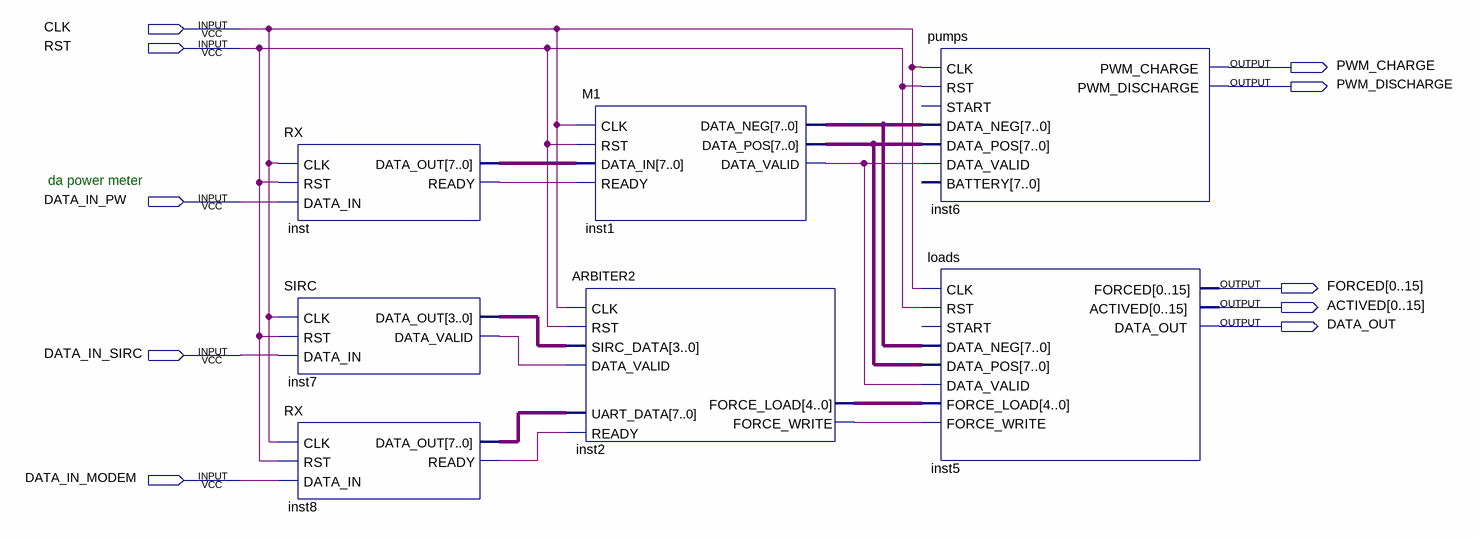
[diagram p0: schematic sheet]
// Quartus schematic innovate.bdf as structural Verilog: 7 symbols, 10 pins
module innovate (
  input  CLK,
  input  RST,
  input  DATA_IN_PW,
  input  DATA_IN_SIRC,
  input  DATA_IN_MODEM,
  output PWM_CHARGE,
  output PWM_DISCHARGE,
  output [0:15] FORCED,
  output [0:15] ACTIVED,
  output DATA_OUT
);

  wire inst1_data_valid, inst2_force_write, inst7_data_valid, inst8_ready, inst_ready;
  wire [3:0] inst7_data_out;
  wire [4:0] inst2_force_load;
  wire [7:0] inst1_data_neg, inst1_data_pos, inst8_data_out, inst_data_out;

  RX inst (.CLK(CLK), .RST(RST), .DATA_IN(DATA_IN_PW), .DATA_OUT(inst_data_out), .READY(inst_ready));
  SIRC inst7 (.CLK(CLK), .RST(RST), .DATA_IN(DATA_IN_SIRC), .DATA_OUT(inst7_data_out), .DATA_VALID(inst7_data_valid));
  RX inst8 (.CLK(CLK), .RST(RST), .DATA_IN(DATA_IN_MODEM), .DATA_OUT(inst8_data_out), .READY(inst8_ready));
  M1 inst1 (
    .CLK(CLK), .RST(RST), .DATA_IN(inst_data_out), .READY(inst_ready), .DATA_NEG(inst1_data_neg),
    .DATA_POS(inst1_data_pos), .DATA_VALID(inst1_data_valid));
  ARBITER2 inst2 (
    .CLK(CLK), .RST(RST), .SIRC_DATA(inst7_data_out), .UART_DATA(inst8_data_out),
    .DATA_VALID(inst7_data_valid), .READY(inst8_ready), .FORCE_LOAD(inst2_force_load),
    .FORCE_WRITE(inst2_force_write));
  pumps inst6 (
    .CLK(CLK), .RST(RST), .DATA_NEG(inst1_data_neg), .DATA_POS(inst1_data_pos),
    .DATA_VALID(inst1_data_valid), .PWM_CHARGE(PWM_CHARGE), .PWM_DISCHARGE(PWM_DISCHARGE));  // open: START, BATTERY
  loads inst5 (
    .CLK(CLK), .RST(RST), .DATA_NEG(inst1_data_neg), .DATA_POS(inst1_data_pos),
    .DATA_VALID(inst1_data_valid), .FORCE_LOAD(inst2_force_load), .FORCE_WRITE(inst2_force_write),
    .FORCED(FORCED), .ACTIVED(ACTIVED), .DATA_OUT(DATA_OUT));  // open: START

  // Notes on the sheet:
  //   da power meter
endmodule
